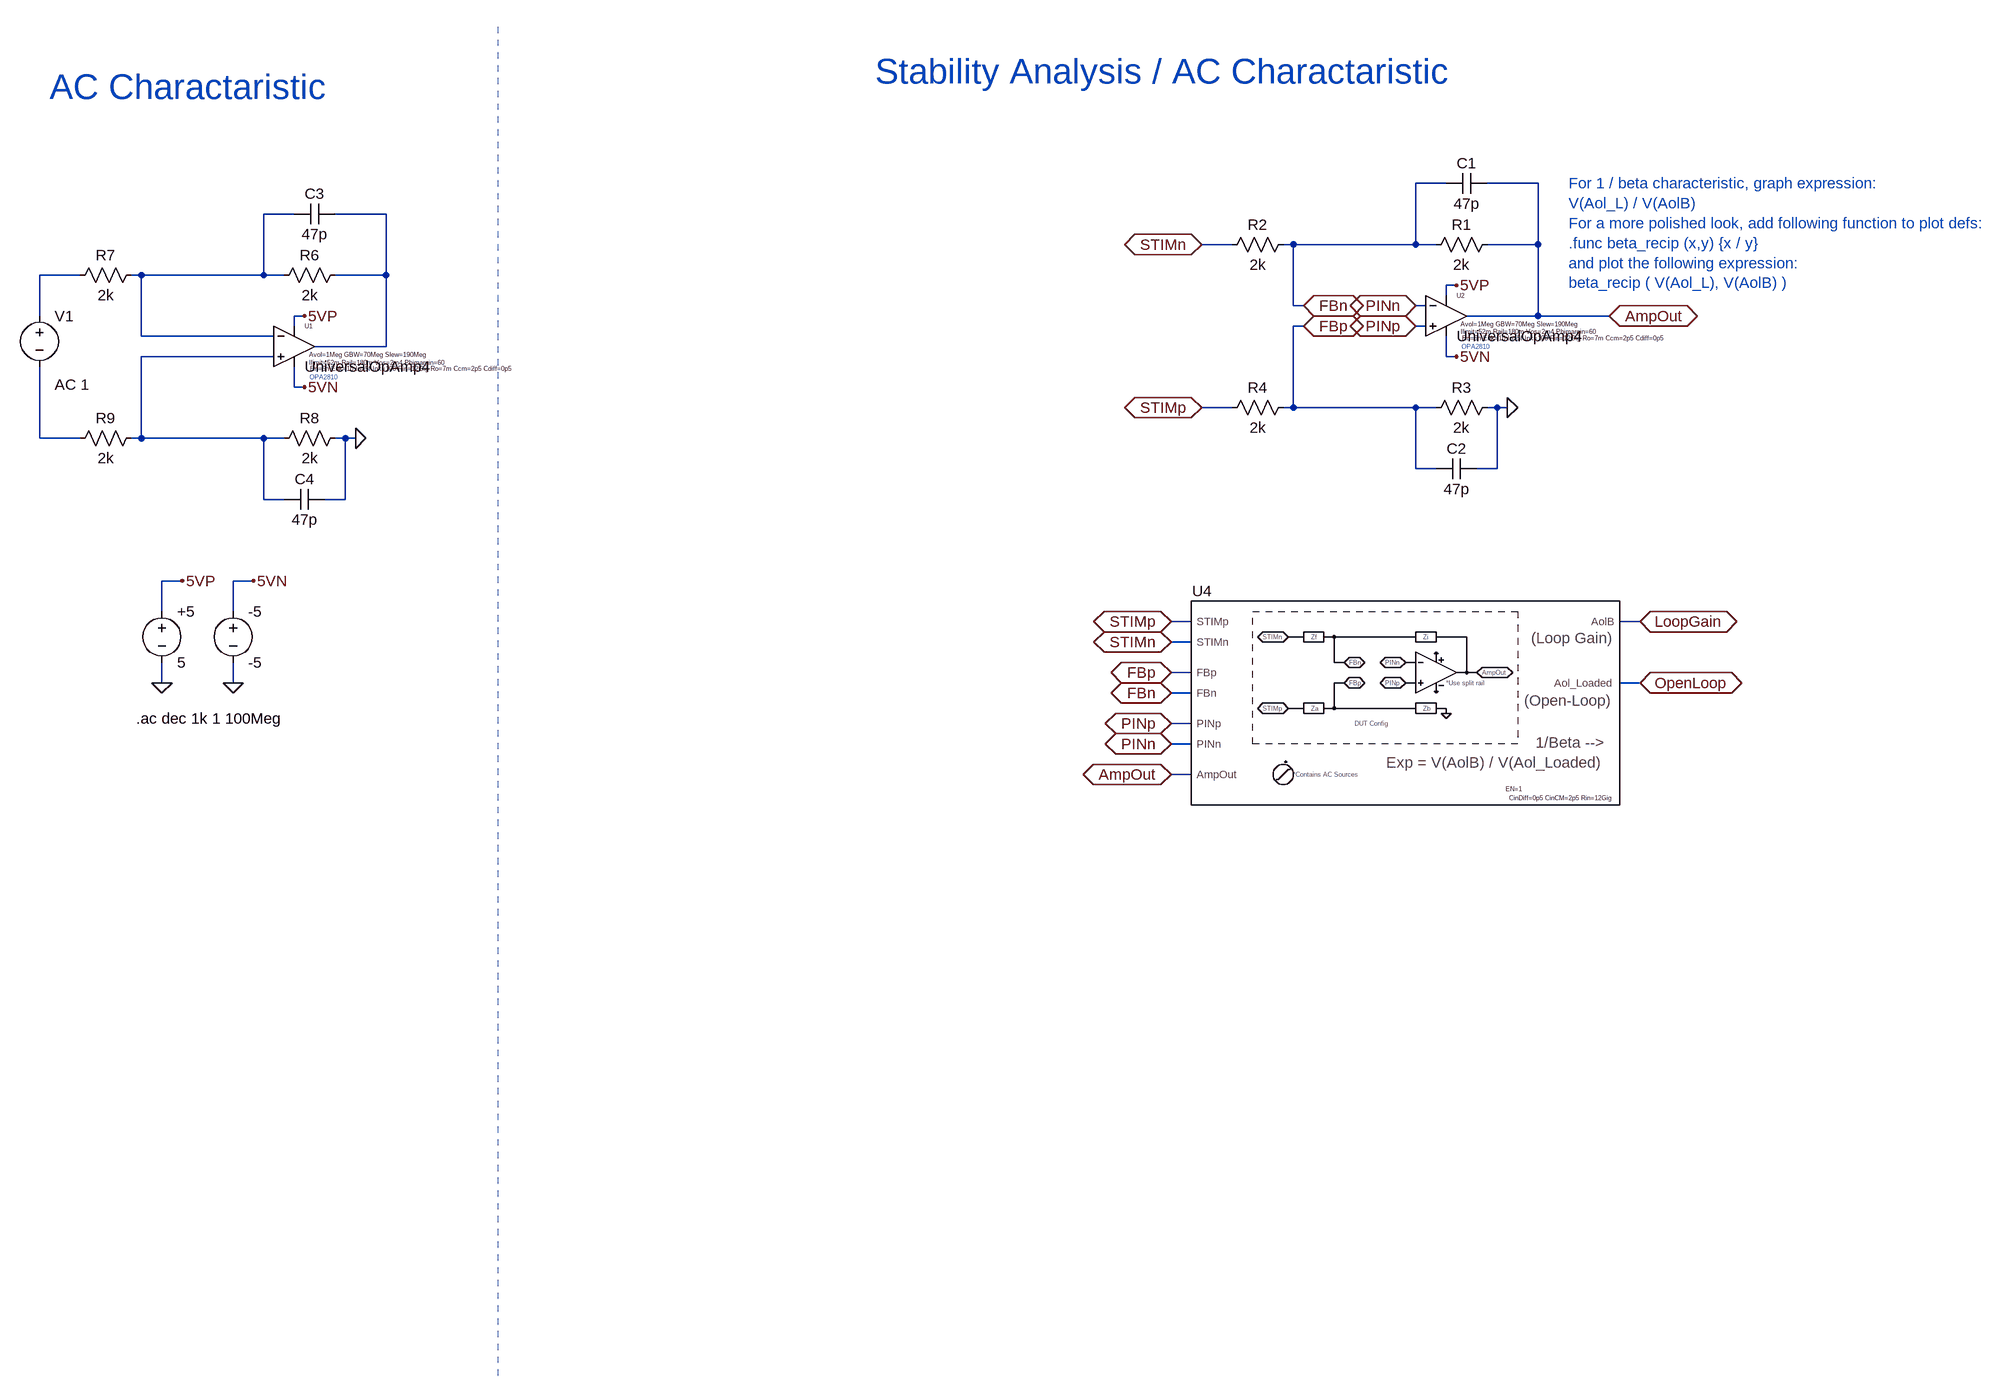
[diagram p0: schematic StabilityAnalysisDiffIntegrated.asc]
StabilityAnalysisDiffIntegrated.asc, the LTspice schematic file:
Version 4
SHEET 1 4368 2164
WIRE 1456 -112 1408 -112
WIRE 1600 -112 1520 -112
WIRE -352 -64 -400 -64
WIRE -208 -64 -288 -64
WIRE 1120 -16 1072 -16
WIRE 1216 -16 1200 -16
WIRE 1408 -16 1408 -112
WIRE 1408 -16 1216 -16
WIRE 1440 -16 1408 -16
WIRE 1600 -16 1600 -112
WIRE 1600 -16 1520 -16
WIRE -688 32 -752 32
WIRE -592 32 -608 32
WIRE -400 32 -400 -64
WIRE -400 32 -592 32
WIRE -368 32 -400 32
WIRE -208 32 -208 -64
WIRE -208 32 -288 32
WIRE 1472 48 1456 48
WIRE 1456 64 1456 48
WIRE 1216 80 1216 -16
WIRE 1232 80 1216 80
WIRE 1424 80 1408 80
WIRE -752 96 -752 32
WIRE -336 96 -352 96
WIRE 1600 96 1600 -16
WIRE 1600 96 1488 96
WIRE 1712 96 1600 96
WIRE -352 112 -352 96
WIRE 1232 112 1216 112
WIRE 1424 112 1408 112
WIRE -592 128 -592 32
WIRE -384 128 -592 128
WIRE -208 144 -208 32
WIRE -208 144 -320 144
WIRE -384 160 -592 160
WIRE 1456 160 1456 128
WIRE 1472 160 1456 160
WIRE -352 208 -352 176
WIRE -336 208 -352 208
WIRE 1120 240 1072 240
WIRE 1216 240 1216 112
WIRE 1216 240 1200 240
WIRE 1408 240 1216 240
WIRE 1440 240 1408 240
WIRE 1536 240 1520 240
WIRE 1552 240 1536 240
WIRE -752 288 -752 176
WIRE -688 288 -752 288
WIRE -592 288 -592 160
WIRE -592 288 -608 288
WIRE -400 288 -592 288
WIRE -368 288 -400 288
WIRE -272 288 -288 288
WIRE -256 288 -272 288
WIRE 1408 336 1408 240
WIRE 1440 336 1408 336
WIRE 1536 336 1536 240
WIRE 1536 336 1504 336
WIRE -400 384 -400 288
WIRE -368 384 -400 384
WIRE -272 384 -272 288
WIRE -272 384 -304 384
WIRE -528 512 -560 512
WIRE -416 512 -448 512
WIRE -560 560 -560 512
WIRE -448 560 -448 512
WIRE 1056 576 1024 576
WIRE 1760 576 1728 576
WIRE 1056 608 1024 608
WIRE 1056 656 1024 656
WIRE -560 672 -560 640
WIRE -448 672 -448 640
WIRE 1760 672 1728 672
WIRE 1056 688 1024 688
WIRE 1056 736 1024 736
WIRE 1056 768 1024 768
WIRE 1056 816 1024 816
FLAG -560 672 0
FLAG -528 512 5VP
FLAG -448 672 0
FLAG -416 512 5VN
FLAG 1472 48 5VP
FLAG 1472 160 5VN
FLAG 1552 240 0
FLAG 1232 80 FBn
IOPIN 1232 80 BiDir
FLAG 1408 80 PINn
IOPIN 1408 80 BiDir
FLAG 1232 112 FBp
IOPIN 1232 112 BiDir
FLAG 1408 112 PINp
IOPIN 1408 112 BiDir
FLAG -336 96 5VP
FLAG -336 208 5VN
FLAG -256 288 0
FLAG 1072 -16 STIMn
IOPIN 1072 -16 BiDir
FLAG 1072 240 STIMp
IOPIN 1072 240 BiDir
FLAG 1712 96 AmpOut
IOPIN 1712 96 BiDir
FLAG 1024 608 STIMn
IOPIN 1024 608 BiDir
FLAG 1024 576 STIMp
IOPIN 1024 576 BiDir
FLAG 1024 688 FBn
IOPIN 1024 688 BiDir
FLAG 1024 768 PINn
IOPIN 1024 768 BiDir
FLAG 1024 656 FBp
IOPIN 1024 656 BiDir
FLAG 1024 736 PINp
IOPIN 1024 736 BiDir
FLAG 1024 816 AmpOut
IOPIN 1024 816 BiDir
FLAG 1760 576 LoopGain
IOPIN 1760 576 BiDir
FLAG 1760 672 OpenLoop
IOPIN 1760 672 BiDir
SYMBOL voltage -560 544 R0
WINDOW 123 0 0 Left 0
WINDOW 39 0 0 Left 0
SYMATTR InstName +5
SYMATTR Value 5
SYMBOL voltage -448 544 R0
WINDOW 123 0 0 Left 0
WINDOW 39 0 0 Left 0
SYMATTR InstName -5
SYMATTR Value -5
SYMBOL OpAmps\\UniversalOpAmp4 1456 96 R0
WINDOW 0 16 -32 Left 0
WINDOW 123 23 13 Left 0
WINDOW 39 23 25 Left 0
WINDOW 40 25 35 Left 0
SYMATTR InstName U2
SYMATTR Value2 Avol=1Meg GBW=70Meg Slew=190Meg
SYMATTR SpiceLine Ilimit=52m Rail=180m Vos=2m4 Phimargin=60
SYMATTR SpiceLine2 En=6n Enk=10 In=5f Ink=100 Rin=12Gig Ro=7m Ccm=2p5 Cdiff=0p5
SYMBOL res 1536 -32 R90
WINDOW 0 0 56 VBottom 2
WINDOW 3 32 56 VTop 2
SYMATTR InstName R1
SYMATTR Value 2k
SYMBOL res 1216 -32 R90
WINDOW 0 0 56 VBottom 2
WINDOW 3 32 56 VTop 2
SYMATTR InstName R2
SYMATTR Value 2k
SYMBOL res 1536 224 R90
WINDOW 0 0 56 VBottom 2
WINDOW 3 32 56 VTop 2
SYMATTR InstName R3
SYMATTR Value 2k
SYMBOL res 1216 224 R90
WINDOW 0 0 56 VBottom 2
WINDOW 3 32 56 VTop 2
SYMATTR InstName R4
SYMATTR Value 2k
SYMBOL cap 1520 -128 R90
WINDOW 0 0 32 VBottom 2
WINDOW 3 32 32 VTop 2
SYMATTR InstName C1
SYMATTR Value 47p
SYMBOL cap 1504 320 R90
WINDOW 0 0 32 VBottom 2
WINDOW 3 32 32 VTop 2
SYMATTR InstName C2
SYMATTR Value 47p
SYMBOL OpAmps\\UniversalOpAmp4 -352 144 R0
WINDOW 0 16 -32 Left 0
WINDOW 123 23 13 Left 0
WINDOW 39 23 25 Left 0
WINDOW 40 25 35 Left 0
SYMATTR InstName U1
SYMATTR Value2 Avol=1Meg GBW=70Meg Slew=190Meg
SYMATTR SpiceLine Ilimit=52m Rail=180m Vos=2m4 Phimargin=60
SYMATTR SpiceLine2 En=6n Enk=10 In=5f Ink=100 Rin=12Gig Ro=7m Ccm=2p5 Cdiff=0p5
SYMBOL res -272 16 R90
WINDOW 0 0 56 VBottom 2
WINDOW 3 32 56 VTop 2
SYMATTR InstName R6
SYMATTR Value 2k
SYMBOL res -592 16 R90
WINDOW 0 0 56 VBottom 2
WINDOW 3 32 56 VTop 2
SYMATTR InstName R7
SYMATTR Value 2k
SYMBOL res -272 272 R90
WINDOW 0 0 56 VBottom 2
WINDOW 3 32 56 VTop 2
SYMATTR InstName R8
SYMATTR Value 2k
SYMBOL res -592 272 R90
WINDOW 0 0 56 VBottom 2
WINDOW 3 32 56 VTop 2
SYMATTR InstName R9
SYMATTR Value 2k
SYMBOL cap -288 -80 R90
WINDOW 0 0 32 VBottom 2
WINDOW 3 32 32 VTop 2
SYMATTR InstName C3
SYMATTR Value 47p
SYMBOL cap -304 368 R90
WINDOW 0 0 32 VBottom 2
WINDOW 3 32 32 VTop 2
SYMATTR InstName C4
SYMATTR Value 47p
SYMBOL voltage -752 80 R0
WINDOW 123 24 124 Left 2
WINDOW 39 0 0 Left 0
SYMATTR Value2 AC 1
SYMATTR InstName V1
SYMATTR Value ""
SYMBOL StabilityAnalysisDiff 1440 688 R0
SYMATTR InstName U4
TEXT -600 728 Left 2 !.ac dec 1k 1 100Meg
TEXT 1480 144 Left 0 ;OPA2810
TEXT 1648 -112 Left 2 ;For 1 / beta characteristic, graph expression:\nV(Aol_L) / V(AolB)\nFor a more polished look, add following function to plot defs:\n.func beta_recip (x,y) {x / y}\nand plot the following expression:\nbeta_recip ( V(Aol_L), V(AolB) )
TEXT -328 192 Left 0 ;OPA2810
TEXT -736 -264 Left 5 ;AC Charactaristic
TEXT 560 -288 Left 5 ;Stability Analysis / AC Charactaristic
LINE Normal -32 1760 -32 -368 2

The netlist it stands for:
* StabilityAnalysisDiffIntegrated.asc
V§+5 5VP 0 5
V§-5 5VN 0 -5
* U2: UniversalOpAmp4 Avol=1Meg GBW=70Meg Slew=190Meg Ilimit=52m Rail=180m Vos=2m4 Phimargin=60 En=6n Enk=10 In=5f Ink=100 Rin=12Gig Ro=7m Ccm=2p5 Cdiff=0p5 (symbol OpAmps\UniversalOpAmp4 not available, pins judged from their places): In+=PINp In-=PINn V+=5VP V-=5VN OUT=AmpOut
R1 AmpOut FBn 2k
R2 FBn STIMn 2k
R3 0 FBp 2k
R4 FBp STIMp 2k
C1 AmpOut FBn 47p
C2 0 FBp 47p
* U1: UniversalOpAmp4 Avol=1Meg GBW=70Meg Slew=190Meg Ilimit=52m Rail=180m Vos=2m4 Phimargin=60 En=6n Enk=10 In=5f Ink=100 Rin=12Gig Ro=7m Ccm=2p5 Cdiff=0p5 (symbol OpAmps\UniversalOpAmp4 not available, pins judged from their places): In+=N004 In-=N001 V+=5VP V-=5VN OUT=N002
R6 N002 N001 2k
R7 N001 N003 2k
R8 0 N004 2k
R9 N004 N005 2k
C3 N002 N001 47p
C4 0 N004 47p
V1 N003 N005 AC 1
XU4 STIMp STIMn FBp FBn PINp PINn AmpOut LoopGain OpenLoop StabilityAnalysisDiff EN=1 CinDiff=0p5 CinCM=2p5 Rin=12Gig  ; pins STIMp STIMn FBp FBn PINp PINn AmpOut AolB Aol_Loaded
.ac dec 1k 1 100Meg
* OPA2810
* For 1 / beta characteristic, graph expression:
* V(Aol_L) / V(AolB)
* For a more polished look, add following function to plot defs:
* .func beta_recip (x,y) {x / y}
* and plot the following expression:
* beta_recip ( V(Aol_L), V(AolB) )
* OPA2810
* AC Charactaristic
* Stability Analysis / AC Charactaristic
.lib StabilityAnalysisDiff.lib
.backanno
.end